# EasyEDA Pro project ProProject_Pet_Tracker_V2_Hardware_PRO.epro, board Main_board_PCB_v1
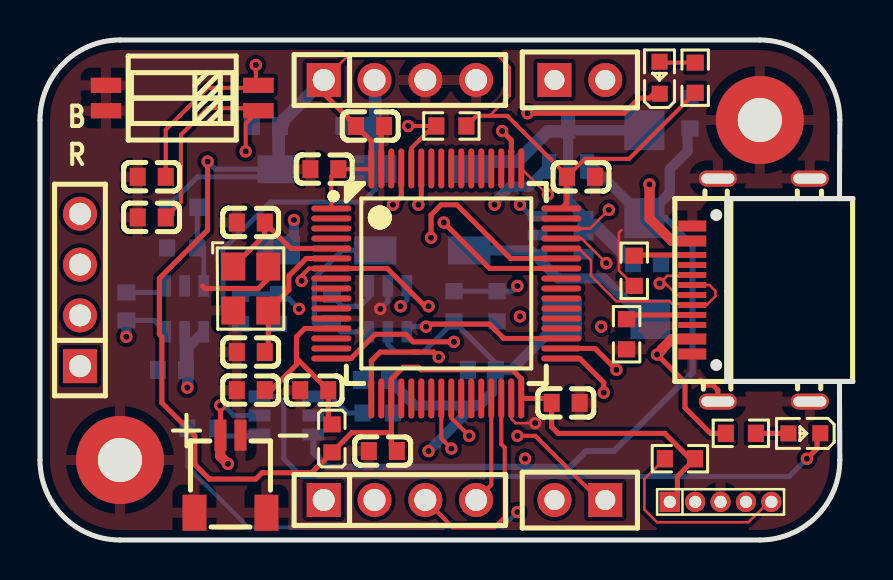
[diagram p2: board, top side]
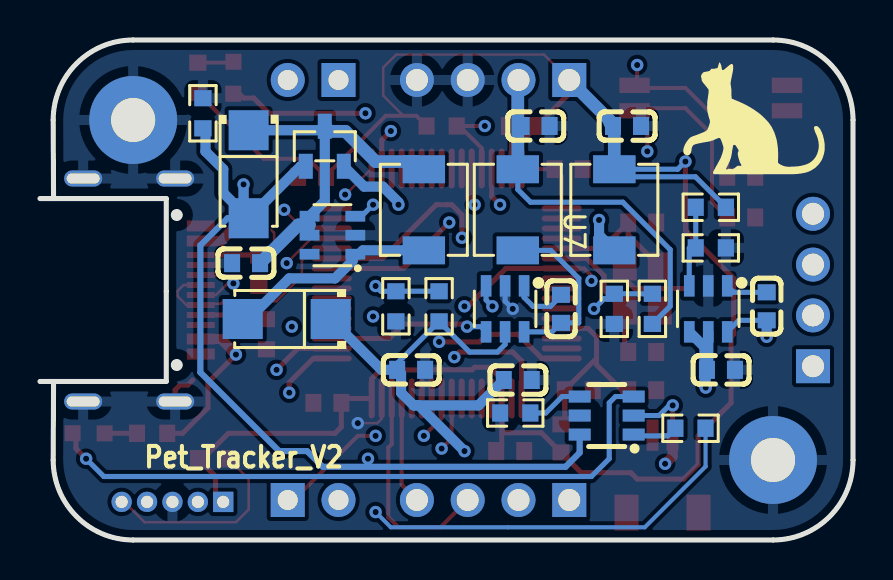
[diagram p3: board, bottom side, seen from below]

Outline 40.66 x 25 mm; copper layers: Top Layer, Inner1, Inner2, Bottom Layer. Coordinates in mm from the lower left corner of the outline.
Outline path: 39.98,17.07 40,21 arc(38.83,23.83) 36,25 4,25 arc(1.17,23.83) 0,21 0,4 arc(1.17,1.17) 4,0 36,0 arc(38.83,1.17) 40,4 39.98,7.93
Stack: Top Layer 0.035mm 外层铜厚1oz / Dielectric1 0.3467mm 7628 RC49% 8.6mil / Inner1 0.035mm 内层铜厚 / Dielectric2 0.3467mm 1.1mm H/HOZ 含铜 / Inner2 0.035mm 内层铜厚 / Dielectric3 0.3467mm 7628 RC49% 8.6mil / Bottom Layer 0.035mm 外层铜厚1oz

## Design rules (mm)
template: User Custom Config
spacing Default: track to track 0.152, other pairs 0 to 0.152
spacing 4-6Layers (default): track to track 0.152, other pairs 0.1 to 0.152
track width Default (default): min 0.127, default 0.127, max 25.4
differential pair differentialPair (default): width min 0.127, default 0.254, max 2.54; gap min 0.152, default 0.152
via Default (default): diameter min 0.61, default 0.61, max 100.025; hole min 0.305, default 0.305, max 59.995
net GND uses gge3958
pour e57 uses gge3992
pour e124 uses gge3976
pour e346 uses gge3925
pour e489 uses gge3958

## Placement (name value [footprint] x y rotation side)
C1  100nF  [C0603]  26.29 6.86 180 top
C2  100nF  [C0603]  17.15 4.44 0 top
C3  100nF  [C0603]  27.05 18.16 180 top
C4  100nF  [C0603]  14.22 18.54 0 top
C5  100nF  [C0603]  16.51 20.7 180 top
C6  1uF  [C0603]  13.72 7.49 0 top
C7  10nF  [C0603]  10.54 7.49 0 top
C8  100nF  [C0603]  5.59 18.16 0 top
C9  100nF  [C0603]  5.59 16.13 0 top
C10  12pF  [C0603]  10.54 9.4 0 top
C11  12pF  [C0603]  10.54 15.88 0 top
C12  22nF  [C0603]  4.32 11.68 270 bottom
C13  22nF  [C0603]  14.6 11.56 270 bottom
C14  22uF  [C0603]  30.35 13.84 180 bottom
C15  22uF  [C0603]  22.1 8.51 0 bottom
C16  22uF  [C0603]  11.3 20.7 0 bottom
C17  22uF  [C0603]  15.88 20.7 0 bottom
C18  22uF  [C0603]  6.6 8.51 0 bottom
C19  22uF  [C0603]  16.76 8 0 bottom
CN1  SM02B-SRSS-TB (LF)(SN)  [CONN-SMD_2P-P1.00_SM02B-SRSS-TB-LF-SN]  9.53 3.3 0 top
H1  I2C  [HDR-TH_4P-P2.54-V-F]  2 12.5 90 top
H2  Power  [HDR-TH_4P-P2.54-V-F]  18 23 0 top
H3  GPIO  [HDR-TH_4P-P2.54-V-F]  18 2 0 top
H5  SWD  [HEADER_1X5_1.27MM]  34.04 1.91 0 top
LED1  RED  [LED0603-RD_RED]  30.99 23.11 90 top
LED2  RED  [LED0603-RD_RED]  38.23 5.33 180 top
MK1  Mounting_Hole_PAD  [MOUNTINGHOLE_2.2MM_M2_PAD]  36 21 0 top
MK2  Mounting_Hole_PAD  [MOUNTINGHOLE_2.2MM_M2_PAD]  4 4 0 top
P1  UART  [HDR-TH_2P-P2.54-V-F]  27 2 180 top
P2  UART_DEBUG  [HDR-TH_2P-P2.54-V-F]  27 23 0 top
R1  100Ω  [R0603]  32.77 23.11 270 top
R2  5.1kΩ  [R0603]  29.72 13.46 90 top
R3  5.1kΩ  [R0603]  29.34 10.29 90 top
R4  10kΩ  [R0603]  8.13 5.59 180 bottom
R5  100kΩ  [R0603]  20.57 20.7 0 top
R6  100kΩ  [R0603]  32 4.06 0 top
R7  560Ω  [R0603]  35.05 5.33 180 top
R8  1kΩ  [R0603]  16.89 6.35 180 bottom
R9  110kΩ  [R0603]  32.51 21.34 90 bottom
R10  110kΩ  [R0603]  20.7 11.68 270 bottom
R11  110kΩ  [R0603]  7.11 16.64 180 bottom
R12  110kΩ  [R0603]  10.03 11.56 270 bottom
R13  15kΩ  [R0603]  22.86 11.68 90 bottom
R14  22.1kΩ  [R0603]  7.11 14.61 0 bottom
R15  17.8kΩ  [R0603]  11.94 11.56 90 bottom
SW1  DSHP02TSGET  [SW-SMD_4P_DSHP02TSGET]  7.11 22.1 90 top
U1  120@100MHz  [L0603]  14.6 5.08 90 top
U2  SS26  [SMA_L4.3-W2.6-LS5.1-RD]  30.23 18.29 270 bottom
U3  STM32F303RBT6  [LQFP-64_L10.0-W10.0-P0.50-LS12.0-BL]  20.32 12.83 270 top
U4  SI2301-ZE  [SOT-23-3_L2.9-W1.3-P1.90-LS2.4-BR]  26.42 19.69 270 bottom
U5  BQ21040DBVR  [SOT-23-6_L2.9-W1.6-P0.95-LS2.8-BR]  12.32 6.22 180 bottom
U6  4.7uH  [IND-SMD_L4.4-W4.2]  11.94 16.51 270 bottom
U7  4.7uH  [IND-SMD_L4.4-W4.2]  16.76 16.51 270 bottom
U8  4.7uH  [IND-SMD_L4.4-W4.2]  21.46 16.51 90 bottom
U9  SS26_C5350986  [SMA_L4.3-W2.6-LS5.1-RD]  28.32 11.05 0 bottom
U10  MT3608L  [SOT-23-6_L2.9-W1.7-P0.95-LS2.8-BL]  26.03 15.24 90 bottom
U11  MT2492  [SOT-23-6_L2.9-W1.6-P0.95-LS2.8-BL]  7.24 11.56 0 bottom
U12  MT2492  [SOT-23-6_L2.9-W1.6-P0.95-LS2.8-BL]  17.4 11.56 0 bottom
USBC1  TYPE-C-31-M-14  [USB-C-SMD_12P-P0.50-H-F_TYPE-C-31-M-14]  35.56 12.5 90 top
X1  16MHz  [OSC-SMD_4P-L3.2-W2.5-BL]  10.54 12.57 270 top

## Footprints (pads in the part's own frame, mm; a bottom-side part is the same pattern mirrored in y, then rotated)
C0603
  rect 0.8x0.9 smd: 1(-0.7,0) 2(0.7,0)
CONN-SMD_2P-P1.00_SM02B-SRSS-TB-LF-SN
  rect 0.6x1.55 smd: 1(-0.5,1.938) 2(0.5,1.938)
  rect 1.2x1.8 smd: 3(1.8,-1.938) 4(-1.8,-1.938)
HDR-TH_2P-P2.54-V-F
  rect 1.7x1.7 hole 1: 1(-1.27,0)
  round 1.7 hole 1: 2(1.27,0)
HDR-TH_4P-P2.54-V-F
  rect 1.7x1.7 hole 1.1: 1(-3.81,0)
  round 1.7 hole 1.1: 2(-1.27,0) 3(1.27,0) 4(3.81,0)
HEADER_1X5_1.27MM
  rect 1.016x1.016 hole 0.61: 1(-2.54,0)
  round 1.016 hole 0.61: 2(-1.27,0) 3(0,0) 4(1.27,0) 5(2.54,0)
IND-SMD_L4.4-W4.2
  rect 1.4x2.12 smd: 1(2.028,0) 2(-2.028,0)
L0603
  rect 0.8x0.864 smd: 1(-0.7,0) 2(0.7,0)
LED0603-RD_RED
  rect 0.8x0.8 smd: 1(-0.799,-0.004) 2(0.799,0.004)
LQFP-64_L10.0-W10.0-P0.50-LS12.0-BL
  oval 0.3x2 smd: 1(-3.75,-5.75) 2(-3.25,-5.75) 3(-2.75,-5.75) 4(-2.25,-5.75) 5(-1.75,-5.75) 6(-1.25,-5.75) 7(-0.75,-5.75) 8(-0.25,-5.75) 9(0.25,-5.75) 10(0.75,-5.75) 11(1.25,-5.75) 12(1.75,-5.75) 13(2.25,-5.75) 14(2.75,-5.75) 15(3.25,-5.75) 16(3.75,-5.75) 33(3.75,5.75) 34(3.25,5.75) 35(2.75,5.75) 36(2.25,5.75) 37(1.75,5.75) 38(1.25,5.75) 39(0.75,5.75) 40(0.25,5.75) 41(-0.25,5.75) 42(-0.75,5.75) 43(-1.25,5.75) 44(-1.75,5.75) 45(-2.25,5.75) 46(-2.75,5.75) 47(-3.25,5.75) 48(-3.75,5.75)
  oval 2x0.3 smd: 17(5.75,-3.75) 18(5.75,-3.25) 19(5.75,-2.75) 20(5.75,-2.25) 21(5.75,-1.75) 22(5.75,-1.25) 23(5.75,-0.75) 24(5.75,-0.25) 25(5.75,0.25) 26(5.75,0.75) 27(5.75,1.25) 28(5.75,1.75) 29(5.75,2.25) 30(5.75,2.75) 31(5.75,3.25) 32(5.75,3.75) 49(-5.75,3.75) 50(-5.75,3.25) 51(-5.75,2.75) 52(-5.75,2.25) 53(-5.75,1.75) 54(-5.75,1.25) 55(-5.75,0.75) 56(-5.75,0.25) 57(-5.75,-0.25) 58(-5.75,-0.75) 59(-5.75,-1.25) 60(-5.75,-1.75) 61(-5.75,-2.25) 62(-5.75,-2.75) 63(-5.75,-3.25) 64(-5.75,-3.75)
MOUNTINGHOLE_2.2MM_M2_PAD
  round 4.4 hole 2.205x2.2: 1(0,0)
OSC-SMD_4P-L3.2-W2.5-BL
  rect 1.4x1.2 smd: 1(-1.1,-0.875) 2(1.1,-0.875) 3(1.1,0.875) 4(-1.1,0.875)
R0603
  rect 0.806x0.864 smd: 1(-0.753,0) 2(0.753,0)
SMA_L4.3-W2.6-LS5.1-RD
  rect 2x2 smd: 1(-2.2,0) 2(2.2,0)
SOT-23-3_L2.9-W1.3-P1.90-LS2.4-BR
  rect 1.25x0.7 smd: 1(1,-0.95) 2(1,0.95) 3(-1,0)
SOT-23-6_L2.9-W1.6-P0.95-LS2.8-BL
  rect 0.532x1.072 smd: 1(-0.95,-1.149) 2(0,-1.149) 3(0.95,-1.149) 4(0.95,1.149) 5(0,1.149) 6(-0.95,1.149)
SOT-23-6_L2.9-W1.6-P0.95-LS2.8-BR
  rect 1.1x0.6 smd: 1(1.35,-0.95) 2(1.35,0) 3(1.35,0.95) 4(-1.35,0.95) 5(-1.35,0) 6(-1.35,-0.95)
SOT-23-6_L2.9-W1.7-P0.95-LS2.8-BL
  rect 0.532x0.99 smd: 1(-0.95,-1.145) 2(0,-1.145) 3(0.95,-1.145) 4(0.95,1.145) 5(0,1.145) 6(-0.95,1.145)
SW-SMD_4P_DSHP02TSGET
  rect 0.762x1.524 smd: 1(-0.635,-3.81) 2(0.635,-3.81) 3(0.635,3.81) 4(-0.635,3.81)
USB-C-SMD_12P-P0.50-H-F_TYPE-C-31-M-14
  oval 0.8x1.9 hole 0.5x1.65: 1(5.575,1.66) 2(-5.575,-2.94) 3(-5.575,1.66) S(5.575,-2.94)
  rect 0.55x1.4 smd: A1B12(-3.2,2.94) A4B9(-2.45,2.94) B1A12(3.2,2.94) B4A9(2.45,2.94)
  rect 0.3x1.4 smd: A5(-1.249,2.94) A6(-0.251,2.94) A7(0.25,2.94) A8(1.25,2.94) B5(1.75,2.94) B6(0.75,2.94) B7(-0.751,2.94) B8(-1.749,2.94)

## Nets
As in the schematic, except:
GND: C1.1 C2.1 C3.1 C4.1 C5.1 C6.1 C7.1 C8.1 C9.1 C10.1 C11.1 C14.1 C15.1 C16.1 C17.1 C18.1 C19.1 CN1.2 CN1.3 CN1.4 H2.3 H2.4 H5.3 MK1.1 MK2.1 R2.1 R3.1 R8.1 R9.2 R13.1 R14.1 R15.1 SW1.3 SW1.4 U3.12 U3.31 U3.47 U3.63 U5.5 U10.2 U11.2 U12.2 USBC1.1 USBC1.2 USBC1.3 USBC1.A1B12 USBC1.B1A12 USBC1.S X1.2 X1.4
GPS_LED: H3.2 U3.33

Pads without a net: U3 2 3 4 8 9 10 11 14 15 18 20 21 22 23 26 27 28 36 37 38 39 40 41 51 52 53 54 55 56 57 58 62; U10 6; USBC1 A8 B8

## Via types
v1: diameter 0.62, hole 0.31, Top Layer to Bottom Layer, 44 vias

## Routing (per net, layer and track width the routed paths; a pad name or vN(x,y) marks a point on that pad's centre or on a via; arc(x,y) is an arc through that point)
3V3: length 107.8
  Top Layer w0.127: 21.84,21.21 22.48,21.21 23.5,22.22 23.5,23.62 22.85,24.27 15.46,24.27 H2.1
  Top Layer w0.203: U3.64 16.53,18.54 C4.2 14.57,18.19 U3.1 ; R1.2 29.46,19.06 27.25,19.06 C3.2 26.35,18.23 23.37,21.21 21.84,21.21 R5.2
  Top Layer w0.254: U3.19 17.57,4.72 C2.2 ; 17.57,7.08 17.57,8.04 18.16,8.64 18.92,8.64 19.05,8.51 23.62,8.51 24.07,8.06 24.07,7.08 ; U3.48 26.35,16.86 C3.2 ; 17.57,5.36 15.59,5.36 U1.1 13.59,3.36 11.11,3.36 10.79,3.05 8.47,3.05 7.75,3.77 7.75,5.21 6.1,6.86 6.1,10.16 5.97,10.29 5.97,13.08 8.38,15.49 v1(8.38,18.92) ; H5.1 31.88,2.29 31.88,3.18 R6.2 32.51,4.06 31.24,5.33 25.91,5.33 25.59,5.65 C1.2 25.37,7.08 U3.32 ; 14.22,23.24 14.22,22.29 C5.2 16.57,19.94 U3.64
  Bottom Layer w0.254: v1(8.38,18.92) 8.77,18.54 U6.2 11.56,18.16 7.88,18.16 R11.2
  Bottom Layer w0.635: U6.2 11.94,20.64 C16.2 12.16,20.86 12.16,20.97 H2.1
3V3A: length 10
  Top Layer w0.254: U3.13 13.24,10.58 12.83,10.16 12.83,9.08 C6.2 14.42,5.97 U1.2 ; 11.24,7.49 11.56,7.49 12.83,8.76 12.83,9.66
4V: length 18.4
  Bottom Layer w0.254: 16.76,18.54 16.76,17.53 16.13,16.89 11.51,16.89 9.14,14.52 9.14,11.69 10.03,10.8
  Bottom Layer w0.635: H2.2 16.76,22.97 U7.2
4V_EN: length 8.2
  Top Layer w0.254: U3.35 23.2,10.08 22.48,10.8 19.43,10.8 v1(19.3,10.67)
  Bottom Layer w0.254: v1(19.3,10.67) 18.61,10.67 U12.4
5V: length 42.9
  Inner2 w0.508: v1(7.37,7.62) 8.19,7.62 8.83,8.25 8.89,8.25 12.7,4.44 v1(19.43,4.44)
  Bottom Layer w0.254: C15.2 22.8,8.83 R10.2 19.18,9.4 17.78,9.4 17.4,9.78 U12.5
  Bottom Layer w0.508: 21.97,6.73 22.6,7.36 22.6,8.31 C15.2 23.58,8.51 U9.1 ; 21.97,6.73 18.73,6.73 C19.2 ; 21.97,6.73 21.72,6.73 v1(19.43,4.44) ; U11.4 7.43,9.65 7.43,7.68 v1(7.37,7.62) 7.37,8.76 7.24,8.88 U11.5
GND: length 14.8
  Top Layer w0.127: 29.08,15.49 28.96,15.37 28.96,13.47 R2.1 ; v1(24.76,5.84) 23.79,5.84 23.57,6.06 U3.31
  Top Layer w0.254: U3.63 17.07,20.56 C5.1 ; 33.02,8 33.27,7.75 33.66,7.75 33.9,7.5 USBC1.3 ; 8.13,12.7 8.25,12.57 10.92,12.57 11.42,13.07 X1.4
  Bottom Layer w0.254: U12.2 17.4,11.94 v1(17.02,11.56)
VIN: length 18.8
  Bottom Layer w0.508: U2.1 26.67,20.49 26.47,20.69 U4.3 26.42,16.95 U10.4 U10.5
  Bottom Layer w0.635: U4.3 26.16,20.43 25.38,20.43 23.88,18.92 21.85,18.92 U8.1 ; 27.18,15.75 27.74,15.75 29.65,13.84
BOOT: length 22
  Top Layer w0.203: v1(10.79,23.75) 10.79,22.99 10.92,22.86 SW1.2 10.79,22.61 8.38,22.61 6.29,20.51 C8.2 ; v1(18.41,20.7) R5.1 19.73,20.61 19.59,20.61 18.57,19.59 U3.60
  Inner1 w0.203: v1(18.41,20.7) 13.84,20.7 v1(10.79,23.75)
C13_1: length 2.9
  Bottom Layer w0.254: U12.1 16.45,12.13 16,11.68 15.13,11.68 14.62,12.19 14.6,12.26
C13_2: length 8.8
  Bottom Layer w0.254: U12.6 15.05,10.41 C13.2 13.72,10.86 13.72,13.08 15.11,14.48 16.76,14.48
CC1: length 3.5
  Top Layer w0.254: 32.62,11.25 29.34,11.25 29.34,11.04
CC2: length 2.9
  Top Layer w0.254: R2.2 29.72,14.25 USBC1.B5
GPS_LED: length 17.3
  Top Layer w0.254: 26.07,9.08 26.99,9.08 28.19,7.87 v1(28.19,7.37)
  Inner1 w0.254: v1(28.19,7.37) 21.97,7.37 19.94,5.33 19.18,5.33 16.89,3.05 16.89,2.16 16.73,2
I2C1_SCL: length 31.1
  Top Layer w0.254: U3.50 23.57,19.99 v1(23.11,20.45)
  Inner2 w0.254: H1.1 2.58,9.27 9.02,9.27 11.94,12.19 17.15,12.19 17.65,12.7 20.63,12.7 21.21,13.28 21.21,17.65 23.11,19.56 v1(23.11,20.45)
I2C1_SDA: length 23.8
  Top Layer w0.254: U3.59 19.07,16.91 v1(18.92,16.76)
  Inner1 w0.254: H1.2 2.23,11.23 2.41,11.05 3.68,12.32 10.61,12.32 12.14,10.8 13.72,10.8 14.1,11.18 15.37,11.18 18.67,14.48 18.67,16.76 v1(18.92,16.76)
I2C2_SCL: length 26.1
  Top Layer w0.254: U3.42 22.49,13.58 v1(20.19,15.88)
  Inner2 w0.254: v1(20.19,15.88) 16.89,15.88 15.37,17.4 3.09,17.4 H1.4
I2C2_SDA: length 28.5
  Top Layer w0.254: U3.43 23.53,14.08 20.84,16.76 20.07,16.76 19.56,16.26 v1(19.56,15.11)
  Inner2 w0.254: H1.3 2.33,14.1 8.25,14.1 10.92,16.76 14.35,16.76 16,15.11 v1(19.56,15.11)
LED1_2: length 1.8
  Top Layer w0.203: LED1.2 31.2,23.91 31.24,23.87 R1.1
LED2_2: length 1.6
  Top Layer w0.254: R7.1 37.43,5.33
M_POWER: length 5.4
  Top Layer w0.203: U3.29 22.57,2.76 H3.4
M_SLEEP: length 20.5
  Top Layer w0.254: U3.34 27.76,9.58 v1(28.83,8.51)
  Inner1 w0.254: 14.19,2 14.22,2.03 14.6,2.03 18.41,5.84 19.18,5.84 21.34,8 27.56,8 27.81,8.25 28.57,8.25 v1(28.83,8.51)
NET_LED: length 10.8
  Top Layer w0.203: 19.27,2 20.63,0.64 22.73,0.64 23.24,1.14 23.24,4.62 23.07,4.79 U3.30
OSC1: length 6.7
  Top Layer w0.254: U3.5 12.54,14.58 C11.2 11.24,15.25 X1.1
OSC2: length 6.8
  Top Layer w0.254: X1.3 11.42,9.57 C10.2 ; U3.6 13.31,14.08 12.45,13.21 12.45,12.5 11.42,11.47
P_LED: length 17.5
  Top Layer w0.254: v1(24.38,21.34) 29.21,21.34 29.97,22.1 30.48,22.1 30.82,22.44 ; v1(17.65,16.76) 18.07,17.18 U3.61
  Inner1 w0.254: v1(17.65,16.76) 22.22,21.34 v1(24.38,21.34)
R12_1: length 12
  Inner2 w0.254: v1(12.95,11.56) 12.95,10.69 13.74,9.91 17.27,9.91 18.03,10.69 v1(18.03,11.68)
  Bottom Layer w0.254: U12.3 18.35,12 v1(18.03,11.68) ; R12.1 R15.2 12.18,12.06 12.45,12.06 v1(12.95,11.56)
RESET: length 57.7
  Top Layer w0.127: H5.5 36.45,1.91 35.43,0.89 30.86,0.89 30.23,1.52 30.23,3.05 R6.1
  Top Layer w0.203: v1(13.08,12.95) 13.08,13.21 13.45,13.58 U3.7 ; v1(10.29,19.43) 10.29,20.83 SW1.1 10.67,21.46 10.54,21.59 8.38,21.59 7.05,20.26 7.05,16.89 C9.2
  Top Layer w0.254: U3.7 17.36,13.58 19.26,11.68 v1(19.43,11.68)
  Inner1 w0.203: v1(10.29,19.43) 10.29,15.88 13.08,13.08 v1(13.08,12.95)
  Inner1 w0.254: v1(24,11.18) 19.94,11.18 v1(19.43,11.68)
  Inner2 w0.254: H5.5 36.58,2.03 29.46,9.14 28.96,9.14 28.45,9.65 25.53,9.65 v1(24,11.18)
SWD_CLK: length 20.3
  Top Layer w0.127: U3.49 25.34,17.31 25.37,17.31 v1(25.4,17.27)
  Inner1 w0.127: v1(28.07,10.67) 32,6.73 32,2.79 32.77,2.03 H5.2
  Inner2 w0.127: v1(28.07,10.67) 28.07,12.06 26.67,13.46 26.67,16 v1(25.4,17.27)
SWDIO: length 20.2
  Top Layer w0.127: v1(28.45,16.51) 27.51,15.58 U3.46
  Inner1 w0.127: v1(28.45,16.51) 32.64,12.32 32.64,5.97 35.31,3.3 H5.4
U5_1: length 2.3
  Bottom Layer w0.254: R4.1 9.26,5.21 10.9,5.21 U5.1
U5_3: length 32.6
  Top Layer w0.254: LED2.1 38.86,5.17 38.86,4.57 v1(38.35,4.06)
  Bottom Layer w0.254: v1(38.35,4.06) 37.47,3.17 13.08,3.17 12.19,4.06 12.19,6.86 11.88,7.17 U5.3
U5_4: length 2.8
  Bottom Layer w0.254: 16.14,6.35 15.37,6.35 14.54,7.17 13.67,7.17
U10_1: length 10.6
  Bottom Layer w0.508: U9.2 30.23,11.05 28.19,13.08 25.91,13.08 25.02,13.97 25.02,14.16 U10.1 24.7,14.29 24.51,14.48 21.46,14.48
U10_3: length 8.6
  Inner2 w0.254: v1(23.88,12.7) 23.88,16.76 v1(24,16.76)
  Bottom Layer w0.254: v1(23.88,12.7) 23.61,12.44 R13.2 R10.1 ; U10.3 24.58,16.19 v1(24,16.76)
U11_1: length 2.1
  Bottom Layer w0.254: C12.1 5.97,12.38 6.29,12.71
U11_3: length 4.3
  Bottom Layer w0.254: R11.1 R14.2 8.19,14.61 8.19,12.7
U11_6: length 15.7
  Inner2 w0.508: v1(12.7,16) 6.86,10.16 v1(4.32,10.16)
  Bottom Layer w0.254: 6.29,10.41 5.71,10.98 C12.2
  Bottom Layer w0.508: U6.1 12.7,15.24 v1(12.7,16) ; v1(4.32,10.16) C12.2
UART1_RX: length 12.2
  Top Layer w0.203: U3.25 20.57,6.1 v1(21.46,5.21)
  Inner1 w0.203: v1(21.46,5.21) 21.46,5.46 22.86,6.86 25.4,6.86 25.91,6.35 25.91,2.26 25.73,2.08 P1.2
UART1_TX: length 12
  Top Layer w0.203: P1.1 27.97,2 24.76,5.21 v1(23.88,5.21) ; v1(20.57,4.57) 20.07,5.08 U3.24
  Inner1 w0.203: v1(23.88,5.21) 23.24,4.57 v1(20.57,4.57)
UART2_RX: length 26.1
  Top Layer w0.254: 16.57,7.08 16.57,8.95 17.02,9.4 18.92,9.4 ; v1(19.94,9.14) 19.69,9.4 18.66,9.4
  Inner1 w0.254: P2.2 28.32,22.95 28.32,20.19 27.31,19.18 27.31,11.43 25.02,9.14 v1(19.94,9.14)
UART2_TX: length 24.8
  Top Layer w0.254: v1(20.7,9.91) 18.67,9.91 18.29,10.29 16.76,10.29 15.55,9.08 U3.16
  Inner1 w0.254: v1(20.7,9.91) 24.26,9.91 26.29,11.94 26.42,11.94 26.54,12.06 26.54,22.19 P2.1
USB_DN: length 11.1
  Top Layer w0.127: USBC1.A7 33.48,12.75 33.78,12.45 33.78,12.19 33.34,11.75 USBC1.B7 ; U3.44 26.95,14.58 27.56,13.97 27.56,13.21 28.83,11.94 31.5,11.94 31.62,11.81 32.56,11.81 32.62,11.75
USB_DP: length 9.5
  Top Layer w0.127: USBC1.B6 32.58,13.21 31.37,13.21 v1(30.99,12.83) 31.28,12.83 31.86,12.25 USBC1.A6 ; U3.45 27.09,15.08 v1(28.32,13.84)
  Inner1 w0.127: v1(28.32,13.84) 29.34,12.83 v1(30.99,12.83)
VB: length 34.8
  Top Layer w0.254: CN1.1 9.03,6.72 v1(9.02,6.73)
  Top Layer w0.508: CN1.1 9.02,4.19 v1(9.4,3.81)
  Inner2 w0.508: v1(22.73,16.76) 22.35,16.76 22.35,4.83 21.05,3.53 9.68,3.53 v1(9.4,3.81)
  Bottom Layer w0.254: v1(9.02,6.73) 9.19,6.73 9.7,6.22 U5.2
  Bottom Layer w0.508: U4.2 24.45,17.67 23.51,17.67 22.73,16.89 v1(22.73,16.76)
VUSB: length 87.5
  Top Layer w0.254: v1(30.86,9.27) 32.26,7.87 32.26,6.6 33.53,5.33 R7.2
  Top Layer w0.508: v1(30.48,17.78) 30.48,16.07 31.6,14.95 USBC1.B4A9 ; v1(30.86,9.27) 31.1,9.51 31.1,9.54 31.6,10.05 USBC1.A4B9
  Inner2 w0.203: v1(24.26,4.06) 23.88,3.68 v1(23.88,1.4)
  Inner2 w0.508: v1(30.48,17.78) 29.59,16.89 29.59,10.54 v1(30.86,9.27)
  Bottom Layer w0.203: v1(24.26,4.06) 24.26,3.83 24.09,3.66 ; R4.2 7.37,3.69 7.37,3.68 10.41,0.64 23.11,0.64 v1(23.88,1.4)
  Bottom Layer w0.305: 13.67,5.27 13.67,4.36 14.37,3.66 26.52,3.66 27.31,4.44 28.7,4.44 32.64,8.38 32.64,14.73 31.28,16.09 U2.2
  Bottom Layer w0.508: v1(30.48,17.78) 30.48,16.51 30.23,16.26 U2.2 ; U4.1 27.63,18.69 U2.2 ; U2.2 31.5,17.36 31.5,18.54 32.38,19.43 32.38,20.46 R9.1

## Copper pours and planes (outline as drawn; the poured copper is in the pictures)
GND on Top Layer: 40,0 0,0 0,36.83 9.65,36.83 9.65,25.15 9.53,25.02 40,25.02
GND on Bottom Layer: 40,25.02 40,0 0.13,0 0,-0.13 0,25.02 9.65,25.02 9.65,36.83 17.4,36.83 17.4,25.02
GND on Inner1: 40,25.02 40,0 0,0 0,25.02 17.4,25.02 17.53,25.15 17.53,36.96 24.26,36.96 24.26,25.02
GND on Inner2: 40.13,25.02 40.13,0.13 -0.13,0.13 -0.13,25.27 24.26,25.27 24.38,25.4 24.38,36.96 24.26,37.08 40.26,37.08 40.26,25.27 40,25.02

## Text on the board
Bottom Silkscreen Layer: Pet_Tracker_V2
Top Silkscreen Layer: B | R | + | -
